# EAGLE design ECG_Combined (EAGLE 6.4)
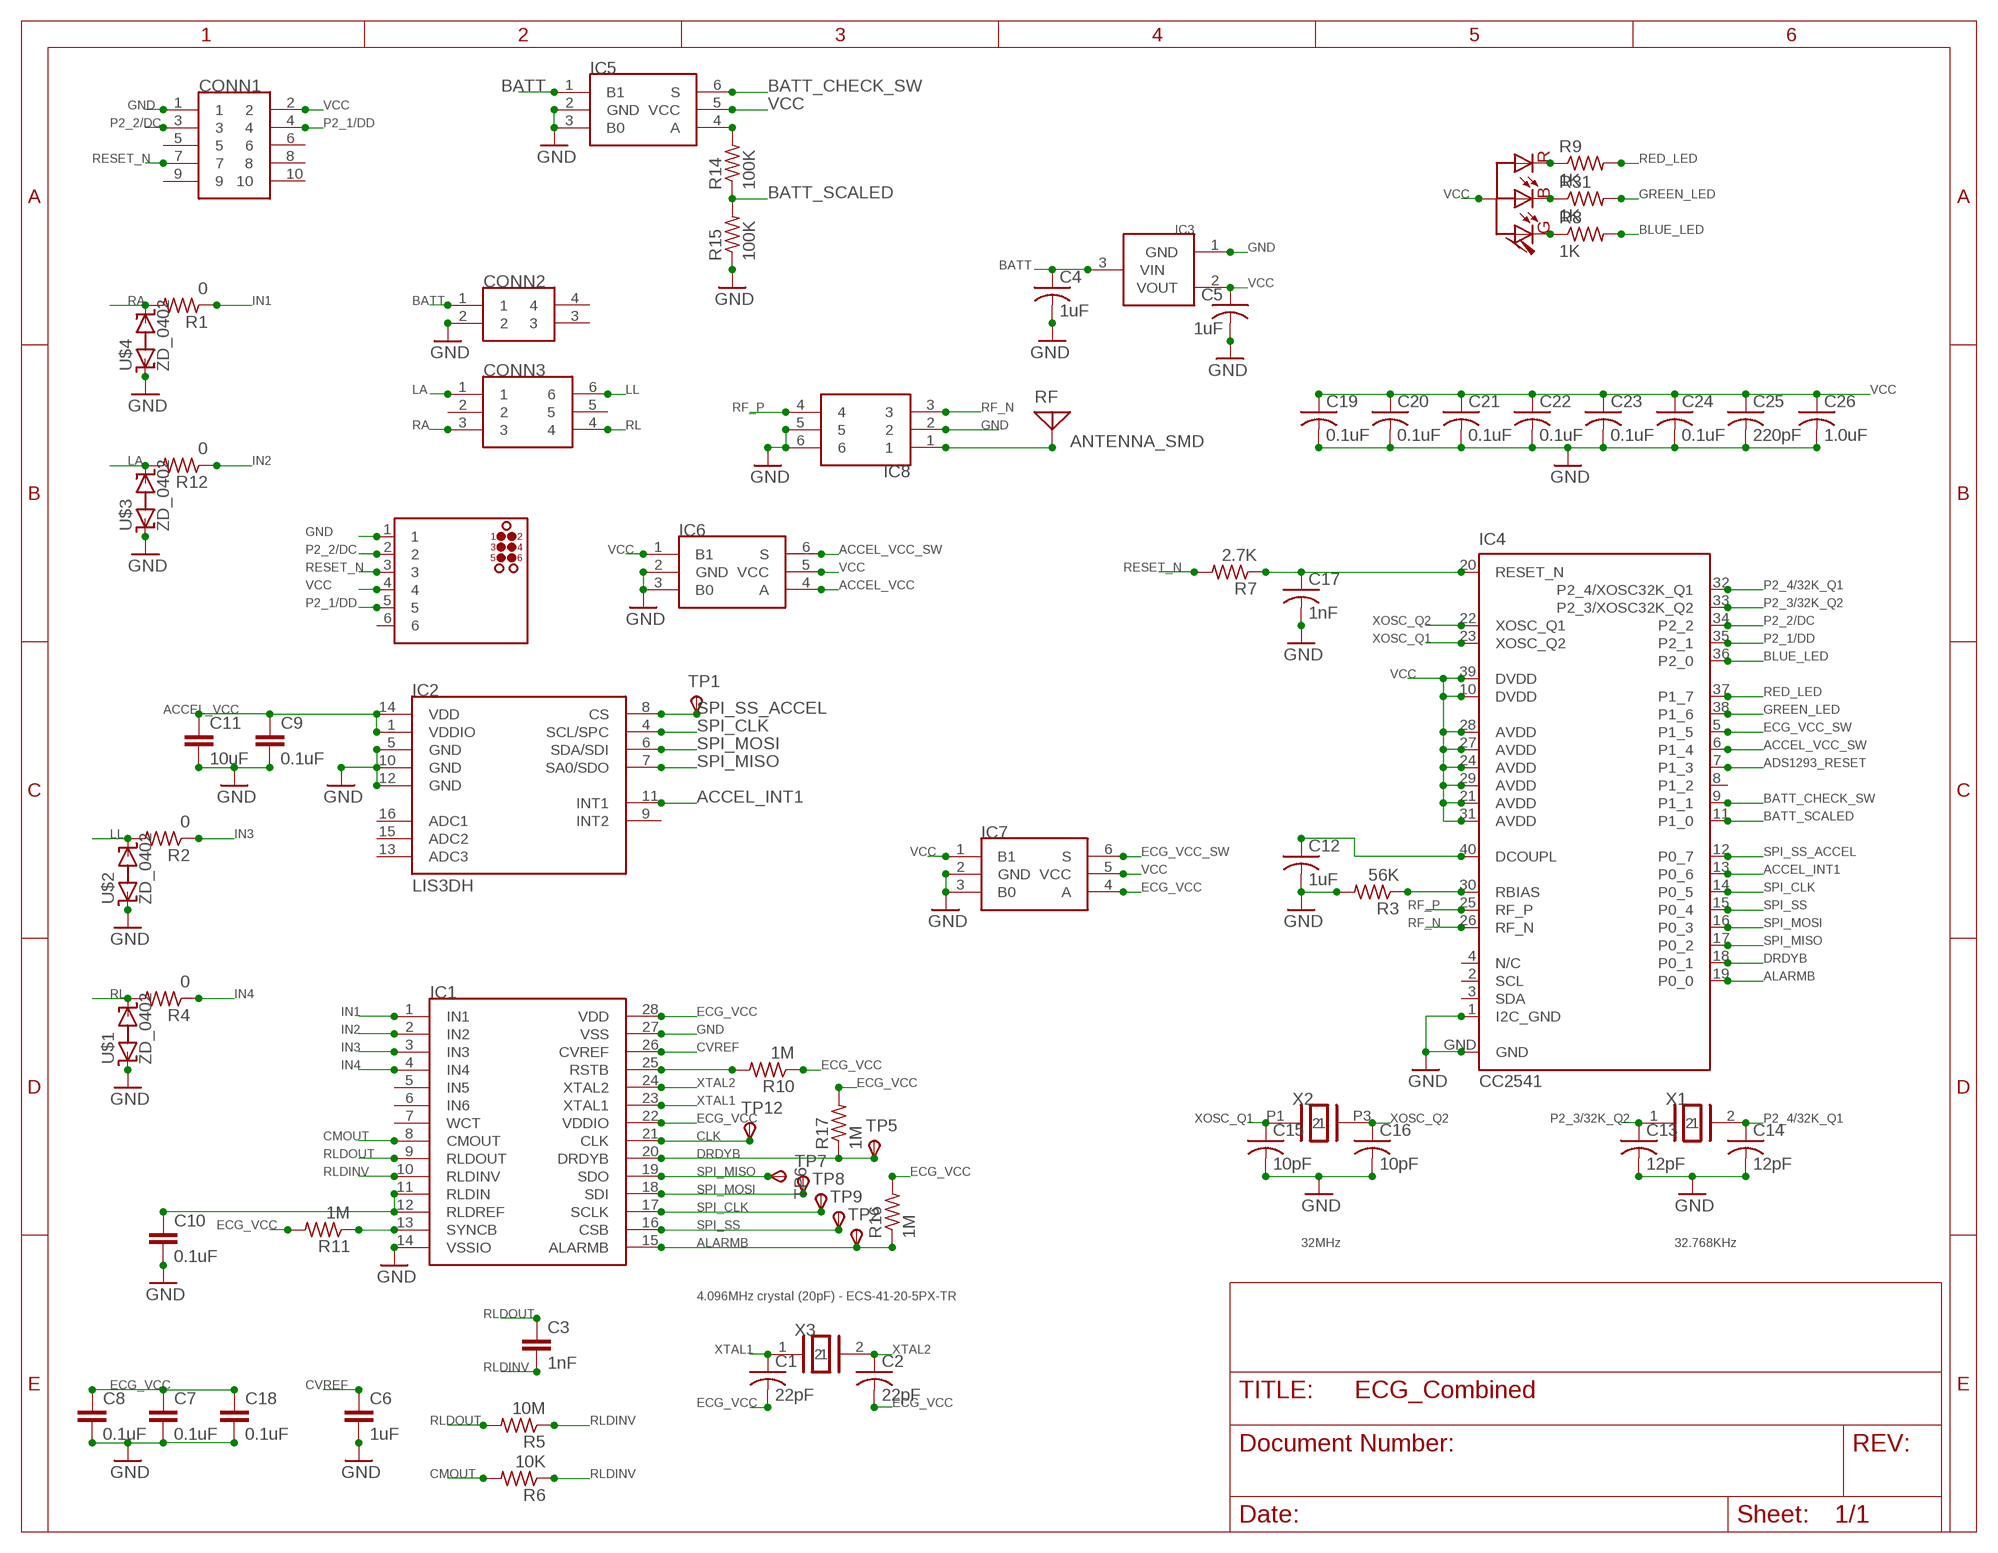
[diagram p0: schematic, sheet 1]

## Parts
C1  22pF  C-USC0201  [C0201]
C2  22pF  C-USC0201  [C0201]
C3  1nF  C-EUC0201  [C0201]
C4  1uF  C-USC0201  [C0201]
C5  1uF  C-USC0201  [C0201]
C6  1uF  C-EUC0201  [C0201]
C7  0.1uF  C-EUC0201  [C0201]
C8  0.1uF  C-EUC0201  [C0201]
C9  0.1uF  C-EUC0201  [C0201]
C10  0.1uF  C-EUC0201  [C0201]
C11  10uF  C-EUC0402  [C0402]
C12  1uF  C-USC0201  [C0201]
C13  12pF  C-USC0201  [C0201]
C14  12pF  C-USC0201  [C0201]
C15  10pF  C-USC0201  [C0201]
C16  10pF  C-USC0201  [C0201]
C17  1nF  C-USC0201  [C0201]
C18  0.1uF  C-EUC0201  [C0201]
C19  0.1uF  C-USC0201  [C0201]
C20  0.1uF  C-USC0201  [C0201]
C21  0.1uF  C-USC0201  [C0201]
C22  0.1uF  C-USC0201  [C0201]
C23  0.1uF  C-USC0201  [C0201]
C24  0.1uF  C-USC0201  [C0201]
C25  220pF  C-USC0201  [C0201]
C26  1.0uF  C-USC0201  [C0201]
CONN1  10POS_1.27MM_SMD  [1.27MM_SMD]
CONN2  M80-4V  [M80-4-V]
CONN3  M80-6V  [M80-6-V]
IC1  ADS1293  [WQFN28]
IC2  LIS3DH  [LGA16-3MM]
IC3  MCP1703  [SOT23]
IC4  CC2541  [RHA_S-PVQFN-N40]
IC5  FSA4157  [SC70-6]
IC6  FSA4157  [SC70-6]
IC7  FSA4157  [SC70-6]
IC8  BALUN_2450BM_SERIES_SMD  [BALUN_SMD_2450BM_SERIES]
R1  0  R-US_R0201  [R0201]
R2  0  R-US_R0201  [R0201]
R3  56K  R-US_R0201  [R0201]
R4  0  R-US_R0201  [R0201]
R5  10M  R-US_R0201  [R0201]
R6  10K  R-US_R0201  [R0201]
R7  2.7K  R-US_R0201  [R0201]
R8  1K  R-US_R0201  [R0201]
R9  1K  R-US_R0201  [R0201]
R10  1M  R-US_R0201  [R0201]
R11  1M  R-US_R0201  [R0201]
R12  0  R-US_R0201  [R0201]
R14  100K  R-US_R0201  [R0201]
R15  100K  R-US_R0201  [R0201]
R16  1M  R-US_R0201  [R0201]
R17  1M  R-US_R0201  [R0201]
R31  1K  R-US_R0201  [R0201]
RF  ANTENNA_SMD  [ANTENNA_SMD]
TP1  TPSTP08SQ  [TP08SQ]
TP2  TPSTP06R  [TP06R]
TP5  TPSTP08SQ  [TP08SQ]
TP6  TPSTP08SQ  [TP08SQ]
TP7  TPSTP08SQ  [TP08SQ]
TP8  TPSTP08SQ  [TP08SQ]
TP9  TPSTP08SQ  [TP08SQ]
TP12  TPSTP06R  [TP06R]
TRI_LED  SML-LX0404SIUPGUSB  [SML-LX0404SIUPGUSB]
U$1  ZD_0402  [0402]
U$2  ZD_0402  [0402]
U$3  ZD_0402  [0402]
U$4  ZD_0402  [0402]
U$5  TC2030-MCP-NL  [TC2030-MCP-NL]
X1  XTAL-2SMD  [2-SMD]
X2  XTAL_403  [4-SMD]
X3  XTAL-CSM7  [CSM-7]

## Nets
ACCEL_INT1: IC2.11(INT1) IC4.13(P0_6)
ACCEL_VCC: C9.1 C11.1 IC2.1(VDDIO) IC2.14(VDD) IC6.4(A)
ACCEL_VCC_SW: IC4.6(P1_4) IC6.6(S)
ADS1293_RESET: IC4.7(P1_3)
ALARMB: IC1.15(ALARMB) IC4.19(P0_0) R16.1 TP2.TP(PP)
BATT: C4.1 CONN2.1 IC3.3(VIN) IC5.1(B1)
BATT_CHECK_SW: IC4.9(P1_1) IC5.6(S)
BATT_SCALED: IC4.11(P1_0) R14.1 R15.2
BLUE_LED: IC4.36(P2_0) R8.2
CLK: IC1.21(CLK) TP12.TP(PP)
CMOUT: IC1.8(CMOUT) R6.2
CVREF: C6.1 IC1.26(CVREF)
DCOUPL: C12.1 IC4.40(DCOUPL)
DRDYB: IC1.20(DRDYB) IC4.18(P0_1) R17.1 TP5.TP(PP)
ECG_VCC: C1.2 C2.2 C7.1 C8.1 C18.1 IC1.22(VDDIO) IC1.28(VDD) IC7.4(A) R10.1 R11.2 R16.2 R17.2
ECG_VCC_SW: IC4.5(P1_5) IC7.6(S)
GND: C4.2 C5.2 C6.2 C7.2 C8.2 C9.2 C10.2 C11.2 C12.2 C13.2 C14.2 C15.2 C16.2 C17.2 C18.2 C19.2 C20.2 C21.2 C22.2 C23.2 C24.2 C25.2 C26.2 CONN1.1 CONN2.2 IC1.14(VSSIO) IC1.27(VSS) IC2.5(GND) IC2.10(GND) IC2.12(GND) IC3.1(GND) IC4.1(I2C_GND) IC4.GND IC5.2(GND) IC5.3(B0) IC6.2(GND) IC6.3(B0) IC7.2(GND) IC7.3(B0) IC8.2 IC8.5 IC8.6 R3.2 R15.1 U$1.1(A) U$2.1(A) U$3.1(A) U$4.1(A) U$5.1
GREEN_LED: IC4.38(P1_6) R31.2
IN1: IC1.1(IN1) R1.1
IN2: IC1.2(IN2) R12.1
IN3: IC1.3(IN3) R2.1
IN4: IC1.4(IN4) R4.1
LA: CONN3.1 R12.2 U$3.2(C)
LL: CONN3.6 R2.2 U$2.2(C)
N$3: R9.1 TRI_LED.3(B)
N$4: IC5.4(A) R14.2
N$5: IC1.25(RSTB) R10.2
N$6: IC8.1 RF.1
N$8: C17.1 IC4.20(RESET_N) R7.1
N$9: R31.1 TRI_LED.4(G)
N$11: C10.1 IC1.11(RLDIN) IC1.12(RLDREF)
N$12: IC1.13(SYNCB) R11.1
N$20: R8.1 TRI_LED.2(R)
P2_1/DD: CONN1.4 IC4.35(P2_1) U$5.5
P2_2/DC: CONN1.3 IC4.34(P2_2) U$5.2
P2_3/32K_Q2: C13.1 IC4.33(P2_3/XOSC32K_Q2) X1.1
P2_4/32K_Q1: C14.1 IC4.32(P2_4/XOSC32K_Q1) X1.2
R_BIAS: IC4.30(RBIAS) R3.1
RA: CONN3.3 R1.2 U$4.2(C)
RED_LED: IC4.37(P1_7) R9.2
RESET_N: CONN1.7 R7.2 U$5.3
RF_N: IC4.26(RF_N) IC8.3
RF_P: IC4.25(RF_P) IC8.4
RL: CONN3.4 R4.2 U$1.2(C)
RLDINV: C3.2 IC1.10(RLDINV) R5.1 R6.1
RLDOUT: C3.1 IC1.9(RLDOUT) R5.2
SPI_CLK: IC1.17(SCLK) IC2.4(SCL/SPC) IC4.14(P0_5) TP8.TP(PP)
SPI_MISO: IC1.19(SDO) IC2.7(SA0/SDO) IC4.17(P0_2) TP6.TP(PP)
SPI_MOSI: IC1.18(SDI) IC2.6(SDA/SDI) IC4.16(P0_3) TP7.TP(PP)
SPI_SS: IC1.16(CSB) IC4.15(P0_4) TP9.TP(PP)
SPI_SS_ACCEL: IC2.8(CS) IC4.12(P0_7) TP1.TP(PP)
VCC: C5.1 C19.1 C20.1 C21.1 C22.1 C23.1 C24.1 C25.1 C26.1 CONN1.2 IC3.2(VOUT) IC4.10(DVDD) IC4.21(AVDD) IC4.24(AVDD) IC4.27(AVDD) IC4.28(AVDD) IC4.29(AVDD) IC4.31(AVDD) IC4.39(DVDD) IC5.5(VCC) IC6.1(B1) IC6.5(VCC) IC7.1(B1) IC7.5(VCC) TRI_LED.1(A) U$5.4
XOSC_Q1: C15.1 IC4.23(XOSC_Q2) X2.P1
XOSC_Q2: C16.1 IC4.22(XOSC_Q1) X2.P3
XTAL1: C1.1 IC1.23(XTAL1) X3.1
XTAL2: C2.1 IC1.24(XTAL2) X3.2
Unconnected: CONN1.5 CONN1.6 CONN1.8 CONN1.9 CONN1.10 CONN2.3 CONN2.4 CONN3.2 CONN3.5 IC1.5(IN5) IC1.6(IN6) IC1.7(WCT) IC2.9(INT2) IC2.13(ADC3) IC2.15(ADC2) IC2.16(ADC1) IC4.2(SCL) IC4.3(SDA) IC4.8(P1_2) U$5.6

## Notes on the sheet
- 32MHz | 32.768KHz
- 4.096MHz crystal (20pF) - ECS-41-20-5PX-TR

## Power pins joined to a net without a drawn wire
N/C: IC4.4(N/C)

## Library data of the parts
C1 C2 C4 C5 C12-C17 C19-C26 = rcl:C-US: CAPACITOR, American symbol
C3 C6-C11 C18 = rcl:C-EU: CAPACITOR, European symbol
CONN1 = harwin:10POS_1.27MM_SMD
CONN2 = harwin:M80-4
CONN3 = harwin:M80-6
IC1 = texas_instruments:ADS1293
IC2 = st:LIS3DH
IC3 = microchip_regulators:MCP1703
IC4 = ST-CC254X:CC2541: CC2541 Bluetooth Smart SoC
IC5-IC7 = fairchild:FSA4157
IC8 = johanson:BALUN_2450BM_SERIES_SMD
R1-R12 R14-R17 R31 = rcl:R-US_: RESISTOR, American symbol
RF = johanson:ANTENNA_SMD
TP1 TP2 TP5-TP9 TP12 = testpad:TPS: TEST PIN
TRI_LED = lumex:SML-LX0404SIUPGUSB
U$1-U$4 = semtech:ZD_0402
U$5 = tagconnect:TC2030: TAG-CONNECT ISP Connector Manufacturer: Tag-Connect <www.tag-connect.com> Cable for easy In-Circuit PCB Programming. Designed for Microchip ICD2, suitable for many others. Two variants - one "with legs" (for hads-free fit on PCB) and another "without legs" for quick programming. PAD Description 1 MCLR/Vpp 2 Vdd 3 GND 4 PGD (ISPDAT) 5 PGC (ISPCLK) 6 nc (used for LVP) ©2009 ROFA.cz
X1 = ecs:XTAL-2SMD
X2 = cts:XTAL_403
X3 = ecs:XTAL-CSM7

## Board
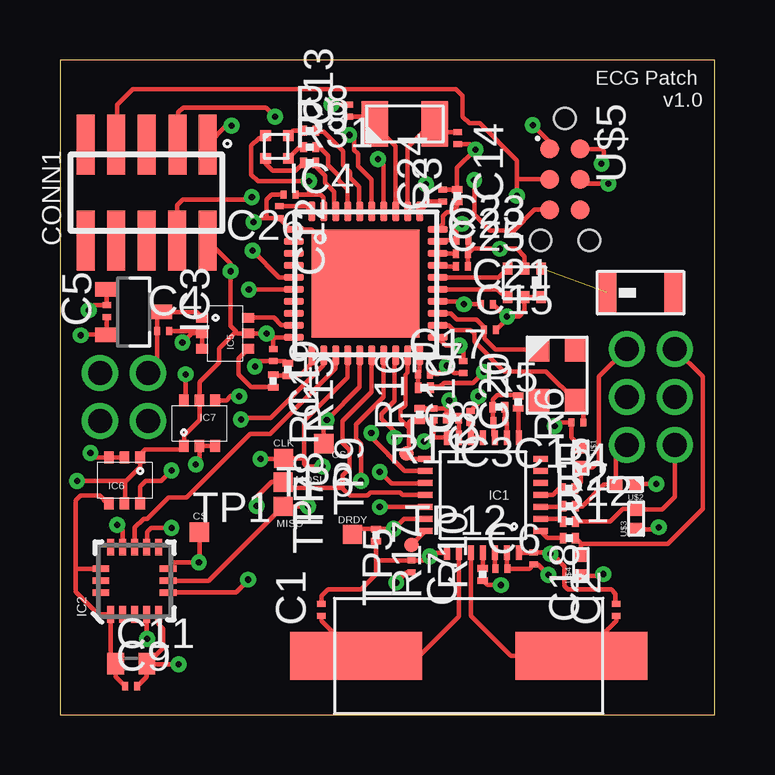
[diagram p1: board, top side]
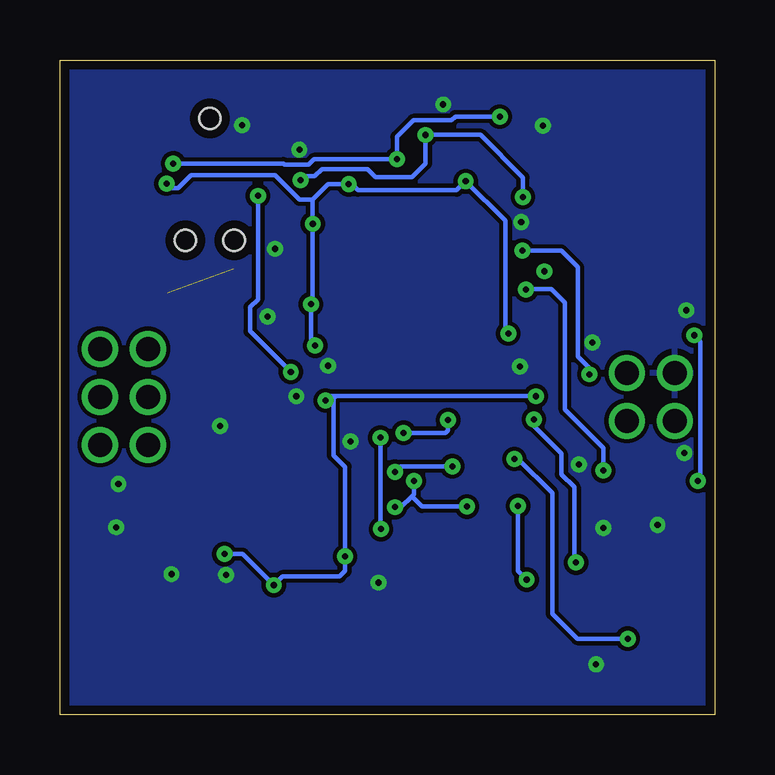
[diagram p2: board, bottom side, seen from below]

Size 27.3 x 27.3 mm. Coordinates in mm from the lower left corner, seen from the top.
Outline: 0,0 27.3,0 27.3,27.3 0,27.3 0,0
Copper layers (1*16): Top 0.035mm / dielectric 0.5mm / Bottom 0.035mm
Design rules "advanced_circuits *": minimum track width 7mil, minimum drill 10mil, track to track 7mil, track to pad 7mil, pad to pad 7mil, via to via 7mil, smd to smd 7mil, copper to edge 15mil, drill to drill 8mil, minimum pad ring 10mil, minimum via ring 8mil, stop-mask expansion 5mil, vias tented up to drill 0mil, thermal gap 10mil

### Footprints (pad centres in the part's own frame; a part is rotated, then mirrored left to right if it is on the bottom)
C0201 = smd 0.25 x 0.35: 1 -0.25,0; 2 0.25,0
C0402 = smd 0.7 x 0.9: 1 -0.65,0; 2 0.65,0
1.27MM_SMD = smd 0.75 x 2.5: 1 -2.6,-2; 2 -2.6,2; 3 -1.35,-2; 4 -1.33,2; 5 -0.06,-2; 6 -0.06,2; 7 1.21,-2; 8 1.21,2; 9 2.48,-2; 10 2.48,2
M80-4-V = drill 1: 1 -1,-1; 2 1,-1; 3 1,1; 4 -1,1
M80-6-V = drill 1: 1 -2,-1; 2 0,-1; 3 2,-1; 4 2,1; 5 0,1; 6 -2,1
WQFN28 = smd 0.6 x 0.25: 1 -2.4,1.5; 2 -2.4,1; 3 -2.4,0.5; 4 -2.4,0; 5 -2.4,-0.5; 6 -2.4,-1; 7 -2.4,-1.5; 15 2.4,-1.5; 16 2.4,-1; 17 2.4,-0.5; 18 2.4,0; 19 2.4,0.5; 20 2.4,1; 21 2.4,1.5 | smd 0.25 x 0.6: 8 -1.5,-2.4; 9 -1,-2.4; 10 -0.5,-2.4; 11 0,-2.4; 12 0.5,-2.4; 13 1,-2.4; 14 1.5,-2.4; 22 1.5,2.4; 23 1,2.4; 24 0.5,2.4; 25 0,2.4; 26 -0.5,2.4; 27 -1,2.4; 28 -1.5,2.4
LGA16-3MM = smd 0.7 x 0.28: 1 -1.4,1; 2 -1.4,0.5; 3 -1.4,0; 4 -1.4,-0.5; 5 -1.4,-1; 9 1.4,-1; 10 1.4,-0.5; 11 1.4,0; 12 1.4,0.5; 13 1.4,1 | smd 0.28 x 0.7: 6 -0.5,-1.4; 7 0,-1.4; 8 0.5,-1.4; 14 0.5,1.4; 15 0,1.4; 16 -0.5,1.4
SOT23 = smd 0.6 x 1: 1 -0.95,-1.1; 2 0.95,-1.1; 3 0,1.1
RHA_S-PVQFN-N40 = smd 0.85 x 0.3: 1 -3,2.25; 2 -3,1.75; 3 -3,1.25; 4 -3,0.75; 5 -3,0.25; 6 -3,-0.25; 7 -3,-0.75; 8 -3,-1.25; 9 -3,-1.75; 10 -3,-2.25; 21 3,-2.25; 22 3,-1.75; 23 3,-1.25; 24 3,-0.75; 25 3,-0.25; 26 3,0.25; 27 3,0.75; 28 3,1.25; 29 3,1.75; 30 3,2.25 | smd 0.3 x 0.85: 11 -2.25,-3; 12 -1.75,-3; 13 -1.25,-3; 14 -0.75,-3; 15 -0.25,-3; 16 0.25,-3; 17 0.75,-3; 18 1.25,-3; 19 1.75,-3; 20 2.25,-3; 31 2.25,3; 32 1.75,3; 33 1.25,3; 34 0.75,3; 35 0.25,3; 36 -0.25,3; 37 -0.75,3; 38 -1.25,3; 39 -1.75,3; 40 -2.25,3 | smd 4.5 x 4.5: GND 0,0
SC70-6 = smd 0.4 x 0.5: 1 -0.7,-0.95; 2 -0.05,-0.95; 3 0.6,-0.95; 4 0.6,0.95; 5 -0.05,0.95; 6 -0.7,0.95
BALUN_SMD_2450BM_SERIES = smd 0.4 x 0.5: 1 0.765,0.631; 2 0.065,0.631; 3 -0.635,0.631; 4 -0.635,-0.569; 5 0.065,-0.569; 6 0.765,-0.569
R0201 = smd 0.28 x 0.43: 1 -0.255,0; 2 0.255,0
ANTENNA_SMD = smd 0.8 x 1.8: 1 1.476,0; 2 -1.324,0
TP08SQ = smd 0.8 x 0.8: TP 0,0
TP06R = smd 0.6 x 0.6: TP 0,0
SML-LX0404SIUPGUSB = smd 0.45 x 0.45: 1 0.45,0.45; 2 0.45,-0.5; 3 -0.5,-0.5; 4 -0.5,0.45
0402 = smd 0.55 x 0.6: 1 -0.451,0; 2 0.399,0
TC2030-MCP-NL = smd 0.787 x 0.787: 1 1.27,-0.635; 2 1.27,0.635; 3 2.54,-0.635; 4 2.54,0.635; 5 3.81,-0.635; 6 3.81,0.635 | hole 0.889: 0,0; 5.08,-1.016; 5.08,1.016
2-SMD = smd 1.1 x 1.9: 1 -1.25,-0.05; 2 1.25,-0.05
4-SMD = smd 1 x 0.9: P1 -1.075,-0.775; P2 1.075,-0.775; P3 1.075,0.775; P4 -1.075,0.775
CSM-7 = smd 5.5 x 2: 1 -4.7,0; 2 4.7,0

### Placement (x,y rotation side)
C1  10.9,4.37 90 top
C2  23.19,4.37 90 top
C3  18.31,12.24 180 top
C4  4.29,16 0 top
C5  1.96,16.84 90 top
C6  18.41,6.1 0 top
C7  14.66,6.2 270 top
C8  15.57,12.52 270 top
C9  2.97,1.19 0 top
C10  17.12,12.42 90 top
C11  2.97,2.13 0 top
C12  9.14,20.95 270 top
C13  12.04,25.2 90 top
C14  16.59,24.05 270 top
C15  17.93,16.05 0 top
C16  21.56,12.19 180 top
C17  15.17,14.21 0 top
C18  19.75,6.53 270 top
C19  8.89,15.01 270 top
C20  16.81,14.5 270 top
C21  17.81,17.12 0 top
C22  16.76,19.23 0 top
C23  16.79,19.79 0 top
C24  15.95,21.64 90 top
C25  16.76,18.69 0 top
C26  9.58,21.69 180 top
CONN1  3.55,21.78 180 top
CONN2  2.67,13.26 180 top
CONN3  24.64,13.26 90 top
IC1  17.64,9.16 180 top
IC2  3.11,5.6 90 top
IC3  3.07,16.8 270 top
IC4  12.75,17.99 0 top
IC5  6.88,15.86 270 top
IC6  2.65,9.77 180 top
IC7  5.87,12.17 0 top
IC8  19.3,17.98 0 top
R1  21.24,7.37 0 top
R2  21.24,8.7 0 top
R3  16.56,21.64 90 top
R4  21.21,9.44 0 top
R5  18.3,12.83 0 top
R6  19.11,13.04 270 top
R7  15.19,13.64 0 top
R8  10.41,24.36 0 top
R9  10.41,23.67 0 top
R10  17.63,5.85 90 top
R11  16.37,12.37 180 top
R12  21.24,8.06 0 top
R14  8.89,13.92 270 top
R15  9.5,14.4 270 top
R16  15,12.52 90 top
R17  13.17,7.49 270 top
R31  10.41,23.01 0 top
RF  24.28,17.6 180 top
TP1  5.82,7.62 0 top
TP2  14.45,10.9 0 top
TP5  12.19,7.52 270 top
TP6  9.3,8.69 0 top
TP7  9.3,9.7 270 top
TP8  9.32,10.69 270 top
TP9  11,11.3 270 top
TP12  14.65,7.08 0 top
TRI_LED  9.02,23.7 90 top
U$1  21.72,10.72 270 top
U$2  23.57,9.6 180 top
U$3  24.03,8.18 90 top
U$4  21.72,6.25 90 top
U$5  21.06,24.87 270 top
X1  14.38,24.69 0 top
X2  20.73,14.16 270 top
X3  17.04,2.46 0 top

### Tracks (layer width: path | path; a pad name or v marks a point on that pad's centre or on a via)
ACCEL_INT1
  Top 0.178: IC4.13 11.5,14.45 8.76,11.71 7.92,11.71 5.28,9.07 4.52,9.07 3.63,8.18 3.48,8.18 3.11,7.81 IC2.11
ACCEL_VCC
  Top 0.178: 0.66,6.15 0.66,5.13 1.6,4.2 IC2.1 2.11,2.35 C11.1 2.32,1.59 C9.1 | IC6.4 1.97,8.82 1.65,9.14 0.86,9.14 0.66,8.94 0.66,6.15 | IC2.14 0.71,6.09 0.66,6.15
ACCEL_VCC_SW  (via drill 0.25)
  Top 0.178: IC6.6 3.35,9.52 3.58,9.75 4.22,9.75 v4.65,10.19 | v7.87,17.73 9.74,17.73 IC4.6
  Bottom 0.178: v4.65,10.19 4.65,11.12 6.25,12.72 6.25,17.2 6.81,17.75 7.85,17.75 v7.87,17.73
ALARMB
  Top 0.178: IC4.19 14.5,14.27 14.4,14.17 14.4,12.93 14.2,12.72 14.2,12.32 14.55,11.96 | R16.1 14.63,12.27 14.55,12.19 14.55,11.96 | 14.55,11.96 14.55,11 TP2.TP 14.69,10.66 IC1.15
BATT
  Top 0.178: 3.76,14.36 CONN2.1 4.04,14.63 C4.1 4.04,16.67 IC3.3 5.69,16.8 IC5.1
BATT_CHECK_SW
  Top 0.178: IC5.6 8.92,16.56 9.22,16.26 9.73,16.26 IC4.9
BATT_SCALED
  Top 0.178: IC4.11 10.5,14.64 10.03,14.17 9.53,14.17 R15.2 8.92,14.15 R14.1
BLUE_LED
  Top 0.178: IC4.36 12.47,21.02 12.47,22.02 12.09,22.4 12.09,22.63 11.81,22.91 11.81,23.5 11,24.31 10.67,24.31 R8.2
CLK
  Top 0.178: TP12.TP IC1.21
CMOUT
  Top 0.178: R6.2 19.11,11.59 IC1.8
CVREF
  Top 0.178: IC1.26 18.14,6.12 C6.1
DCOUPL
  Top 0.178: C12.1 10.29,21.2 IC4.40
DRDYB  (via drill 0.25)
  Top 0.178: IC1.20 14.33,8.16 v13.92,7.75 R17.1 12.42,7.75 TP5.TP | IC4.18 13.95,14.94 13.95,13.08 13.41,12.55 13.41,12.34 13.95,11.81 v13.95,11.56
  Bottom 0.178: v13.95,11.56 13.95,7.77 v13.92,7.75
ECG_VCC  (via drill 0.25)
  Top 0.178: R16.2 C8.1 16.11,12.77 16.12,12.78 | IC7.4 6.94,13.12 7.11,13.28 v7.47,13.28 | R11.2 16.12,12.78 | 16.12,12.78 16.12,12.99 v16.23,13.11 | IC1.28 19.73,6.76 C18.1 20.38,6.78 v20.45,6.71 20.52,6.71 21.03,6.2 21.03,5.38 21.18,5.23 22.99,5.23 23.16,5.05 23.16,4.64 C2.2 | v18.39,5.41 17.82,5.41 R10.1 | IC1.22 15.58,6.76 v15.42,6.6 15.26,6.45 C7.1 13.18,6.45 13.17,6.45 | R17.2 13.17,6.45 | 13.17,6.45 13.17,5.86 12.55,5.23 11.18,5.23 10.9,4.95 C1.2
  Bottom 0.178: v7.47,13.28 15.8,13.28 | 15.8,13.28 16.05,13.28 v16.23,13.11 | 15.8,13.28 15.9,13.18 15.9,10.82 15.42,10.34 v15.42,6.6 15.42,5.99 15.65,5.77 18.03,5.77 v18.39,5.41 19.68,6.71 v20.45,6.71
ECG_VCC_SW  (via drill 0.25)
  Top 0.178: IC4.5 9.14,18.24 v8.03,19.36 | v5.23,14.2 5.23,13.18 IC7.6
  Bottom 0.178: v8.03,19.36 6.4,19.36 5.71,18.67 5.71,14.94 5.23,14.45 v5.23,14.2 5.23,14.17
GND  (via drill 0.25)
  Top 0.178: C23.2 17.01,19.79 C22.2 | C25.2 C22.2 | C22.2 17.22,19.43 v18.34,19.43 19.05,19.43 19.37,19.11 IC8.2 | 9.73,20.22 IC4.1 | C13.2 v11.33,25.45 | IC4.1 9.61,20.24 C12.2 8.59,20.7 | IC4.1 10.5,20.24 IC4.GND | 8.59,20.7 8.23,20.7 v8.08,20.55 | C26.2 8.81,21.69 8.61,21.49 8.61,20.73 8.59,20.7 | R3.2 C24.2 | R3.2 | 18.05,17.07 C21.2 18.56,16.61 | 18.56,16.61 v18.64,16.61 19.13,16.61 19.37,16.85 IC8.5 IC8.6 | 18.56,16.61 18.56,16.43 C15.2 | IC5.2 5.91,15.93 5.51,15.93 v5.11,15.52 | IC5.2 IC5.3 | R15.1 9.39,14.76 C19.2 8.36,14.76 v8.13,14.53 | IC6.2 IC6.3 1.47,10.72 v1.27,10.92 | U$5.1 20.42,23.88 v19.71,24.59 | C14.2 17.09,23.8 v17.32,23.57 16.56,22.81 R3.2 | C4.2 5.84,16 IC5.2 | IC3.1 1.96,17.73 C5.2 1.42,17.09 v1.19,16.87 | IC2.5 4.11,3.76 4.29,3.58 4.29,2.8 C11.2 | C11.2 3.62,1.59 C9.2 | v4.65,7.8 3.81,7.8 3.63,7.62 3.63,7.02 IC2.10 | v7.16,24.56 6.94,24.56 CONN1.1 | IC7.3 IC7.2 5.82,10.59 v5.66,10.44 | IC1.14 15.54,11.56 | C8.2 15.57,11.59 15.54,11.56 | v17.45,13.28 17.45,13 C10.2 | 15.54,11.56 15.35,11.56 v15.19,11.4 | v20.62,12.04 20.78,12.19 C16.2 21.32,11.57 U$1.1 | C17.2 15.78,14.21 v16.13,14.55 16.43,14.25 C20.2 | v20.37,5.84 19.93,6.28 C18.2 19.56,6.1 C6.2 18.64,6.12 IC1.27 | C7.2 14.46,5.95 v14.02,5.51 | v24.87,9.63 24.05,9.63 U$2.1 | U$3.1 24.87,7.73 v24.97,7.82 | IC2.12 2.61,7.7 v2.39,7.92 | U$4.1 22.59,5.8 v22.66,5.87 | v4.95,2.11 3.65,2.11 C11.2
  pour Bottom: 0,27.3 0,0 27.3,0 27.3,27.3
GREEN_LED
  Top 0.178: 11.48,21.01 IC4.38 11.43,21.06 11.43,21.82 11.05,22.2 11.05,22.48 10.67,22.86 R31.2
IN1
  Top 0.178: R1.1 20.33,7.37 IC1.1
IN2
  Top 0.178: IC1.2 20.88,8.16 R12.1
IN3
  Top 0.178: IC1.3 20.95,8.66 R2.1
IN4
  Top 0.178: R4.1 20.82,9.44 20.55,9.17 IC1.4
LA
  Top 0.178: CONN3.1 25.64,9.08 25.12,8.56 24.05,8.56 U$3.2 23.46,8.58 22.95,8.06 R12.2
LL
  Top 0.178: CONN3.6 23.17,10.79 U$2.2 22.68,9.6 21.78,8.7 R2.2
N$3
  Top 0.178: R9.1 9.99,23.67 TRI_LED.3
N$4
  Top 0.178: R14.2 7.98,13.66 7.44,14.2 7.44,14.86 IC5.4
N$5
  Top 0.178: IC1.25 R10.2
N$6  (1 unrouted)
N$8
  Top 0.178: IC4.20 15,14.29 C17.1 14.92,13.65 R7.1
N$9
  Top 0.178: 10.16,22.91 R31.1 9.83,22.68 8.87,22.68 8.57,22.98 TRI_LED.4
N$11
  Top 0.178: C10.1 17.12,11.58 IC1.12 IC1.11
N$12
  Top 0.178: 16.6,11.6 IC1.13 16.63,11.57 R11.1
N$20
  Top 0.178: R8.1 9.73,24.36 TRI_LED.2
P2_1/DD  (via drill 0.25)
  Top 0.178: IC4.35 13,22.31 12.42,22.89 12.42,23.39 12.27,23.55 12.27,23.98 v12.06,24.18 | v8,21.59 7.9,21.49 5.11,21.49 4.88,21.26 CONN1.4 | U$5.5 19.79,21.06 18.92,20.19 17.93,20.19 17.27,20.85 v17.27,22.3
  Bottom 0.178: v8,21.59 8,22.4 9.78,24.18 v12.06,24.18 12.06,22.99 12.62,22.43 14.15,22.43 14.48,22.76 16.38,22.76 16.69,22.45 17.12,22.45 v17.27,22.3
P2_2/DC  (via drill 0.25)
  Top 0.178: IC4.34 13.5,22.92 v13.26,23.16 | U$5.2 22.58,23.6 22.68,23.5 22.68,23.09 v22.58,22.99 | CONN1.3 4.93,23.8 4.93,25.12 5.13,25.32 8.59,25.32 v8.97,24.94
  Bottom 0.178: v22.58,22.99 17.98,22.99 17.93,22.94 16.94,22.94 16.71,23.16 v13.26,23.16 13.26,24.11 12.57,24.79 10.97,24.79 10.82,24.94 v8.97,24.94
P2_3/32K_Q2
  Top 0.178: IC4.33 14,23.72 13.13,24.59 X1.1 12.82,24.95 C13.1
P2_4/32K_Q1
  Top 0.178: IC4.32 14.5,23.64 15.49,24.64 X1.2 15.96,24.3 C14.1
R_BIAS
  Top 0.178: R3.1 16.56,21.18 16.33,20.95 16.13,20.95 15.98,20.8 15.98,20.47 IC4.30
RA
  Top 0.178: U$4.2 21.72,7.14 | 21.72,7.14 R1.2 | 21.72,7.14 21.73,7.14 25.35,7.14 26.8,8.59 26.8,14.1 CONN3.3
RED_LED
  Top 0.178: IC4.37 12,21.91 11.61,22.3 11.61,22.48 11.18,22.91 11.18,23.32 10.82,23.67 R9.2
RESET_N  (via drill 0.25)
  Top 0.178: U$5.3 19.07,22.33 19.05,22.3 | 17.65,14.3 v17.68,14.3 17.22,13.84 16,13.84 15.85,13.69 15.49,13.69 R7.2 | v19.05,21.64 19.05,22.3 | 19.05,22.3 19.05,23.11 17.5,24.66 17.07,24.66 16.79,24.94 16.79,25.81 16.51,26.09 3.02,26.09 2.39,25.45 2.39,23.82 CONN1.7
  Bottom 0.178: v17.68,14.3 19.38,16 19.38,16.99 19.05,17.32 v19.05,21.64
RF_N
  Top 0.178: IC4.26 18.29,18.24 18.66,18.61 IC8.3
RF_P
  Top 0.178: IC4.25 18.25,17.74 18.57,17.41 IC8.4
RL
  Top 0.178: U$1.2 22.2,10.31 22.48,10.59 22.48,14.1 CONN3.4 | U$1.2 | U$1.2 21.72,9.7 R4.2
RLDINV
  Top 0.178: IC1.10 18.06,11.63 C3.2 18.05,12.26 R5.1 18.05,13.14 18.24,13.34 19.07,13.34 R6.1
RLDOUT
  Top 0.178: IC1.9 18.64,12.17 C3.1 R5.2
SPI_CLK  (via drill 0.25)
  Top 0.178: IC4.14 12,14.06 10.19,12.24 10.19,10.67 | v8.36,10.67 9.3,10.67 TP8.TP | IC2.4 3.61,3.2 v3.63,3.17 | 9.47,10.85 TP8.TP | IC1.17 15.23,9.65 13.82,9.65 v13.34,10.13 | v10.95,10.36 10.29,10.36 10.19,10.46 10.19,10.67 | TP8.TP 10.16,10.69 10.19,10.67
  Bottom 0.178: v8.36,10.67 8.2,10.67 6.78,9.25 6.78,4.22 5.74,3.17 v3.63,3.17 | v10.95,10.36 13.11,10.36 v13.34,10.13
SPI_MISO  (via drill 0.25)
  Top 0.178: IC2.7 6.21,5.59 TP6.TP v10.34,8.69 | IC4.17 13.49,14.98 13.49,13.26 12.34,12.12 12.34,11.51 12.55,11.3 v12.55,9.75 | v13.34,8.66 IC1.19
  Bottom 0.178: v12.55,9.75 12.55,9.2 12.64,9.11 | 12.64,9.11 13.08,8.66 v13.34,8.66 | v10.34,8.69 12.22,8.69 12.64,9.11
SPI_MOSI  (via drill 0.25)
  Top 0.178: v8.2,8.71 8.2,9.09 8.81,9.7 TP7.TP 9.53,9.47 11.73,9.47 11.79,9.53 | v7.85,5.64 7.85,5.61 7.34,5.11 IC2.6 | IC4.16 13,13.46 11.79,12.24 11.79,11.33 12.06,11.05 12.06,10.26 11.79,9.98 11.79,9.53 | 15.22,9.14 IC1.18 15.23,9.17 14.28,9.17 14.17,9.27 12.95,9.27 12.83,9.14 12.09,9.14 11.79,9.45 11.79,9.53
  Bottom 0.178: v8.2,8.71 8.2,5.99 v7.85,5.64
SPI_SS  (via drill 0.25)
  Top 0.178: IC4.15 12.5,13.67 v11.12,12.29 11,12.17 TP9.TP | IC1.16 14.38,10.16 12.98,11.56 v12.98,11.76
  Bottom 0.178: v11.12,12.29 11.12,11.86 11.23,11.76 v12.98,11.76
SPI_SS_ACCEL  (via drill 0.25)
  Top 0.178: IC4.12 11,14.58 8.79,12.37 7.59,12.37 v7.54,12.32 | IC2.8 4.76,6.35 v5.79,6.35 5.82,6.38 TP1.TP
  Bottom 0.178: v7.54,12.32 7.54,12.04 6.4,10.9 6.4,10.03 5.87,9.5 5.87,6.43 v5.79,6.35
VCC  (via drill 0.25)
  Top 0.178: 15.05,20.99 IC4.31 15.4,21.39 | 15.77,18.72 IC4.27 | C22.1 15.76,19.23 IC4.28 | C25.1 15.79,18.69 IC4.27 | IC4.28 IC4.29 15.8,19.79 C23.1 16.54,20.25 v16.76,20.47 | IC4.28 IC4.27 | IC4.39 11,21.56 10.87,21.69 10.34,21.69 | 10.34,21.69 C26.1 | 10.34,21.69 10.39,21.74 v10.39,22.25 8.26,22.25 7.98,22.53 7.98,23.72 8.31,24.05 8.47,24.05 TRI_LED.1 | v15.27,22.12 15.27,21.53 15.4,21.39 | C24.1 15.4,21.39 | IC4.24 16.72,17.24 v16.84,17.12 C21.1 | v8.61,15.9 v8.61,15.91 IC5.5 7.41,15.91 7.34,15.98 | IC4.10 8.77,15.74 v8.61,15.9 | 7.34,15.98 7.11,16.2 v7.11,18.49 7.11,18.82 CONN1.2 | C19.1 8.89,15.62 v8.61,15.9 | 2.72,9.7 3.35,10.33 IC6.1 3.35,10.86 3.56,11.07 5.03,11.07 IC7.1 5.17,11.64 5.82,12.29 IC7.5 5.82,13.87 6.63,14.68 6.63,15.27 7.34,15.98 | 2.72,9.7 2.72,8.85 IC6.5 | v0.71,9.75 2.67,9.75 2.72,9.7 | C5.1 1.96,15.87 | 1.96,15.87 IC3.2 | 1.96,15.87 0.9,15.87 v0.86,15.82 | IC4.21 16.1,15.39 v16.66,15.39 16.82,15.24 C20.1 | v22.86,22.15 21.87,22.15 U$5.4
  Bottom 0.178: 16.76,21.49 v16.76,20.47 16.76,17.2 v16.84,17.12 16.84,15.52 16.71,15.39 v16.66,15.39 | v8.61,15.9 8.74,16.03 8.74,20.6 v10.39,22.25 10.77,21.87 14.88,21.87 15.14,22.12 v15.27,22.12 16.13,22.12 16.76,21.49 | v0.71,9.75 0.61,9.86 0.61,15.57 v0.86,15.82 | v22.86,22.15 22.68,21.97 22.38,21.97 21.84,22.5 18.34,22.5 17.32,21.49 16.76,21.49
XOSC_Q1
  Top 0.178: IC4.23 16.3,16.74 16.56,16.48 17.37,16.48 17.68,16.18 C15.1 17.7,16.03 17.7,15.7 18.16,15.24 X2.P1
XOSC_Q2
  Top 0.178: IC4.22 16.22,16.24 16.41,16.05 17.12,16.05 17.27,15.9 17.27,15.57 18.52,14.33 20.26,14.33 X2.P3 | 21.26,12.85 X2.P3 | C16.1 21.82,12.77 X2.P3
XTAL1
  Top 0.178: IC1.23 16.64,4.11 14.99,2.46 X3.1 10.9,3.91 C1.1
XTAL2
  Top 0.178: IC1.24 17.14,4.12 18.8,2.46 X3.2 23.19,3.91 C2.1

### Text on the board
tPlace: ECG Patch | v1.0 | CLK | CS | MOSI | CS | MISO | DRDY
Document: TO-DO: Calculate trace width for 50ohm impedence